# Altium schematic sheet Power Supply and Regulation.SchDoc: Power Supply and Regulation Section
size A4; DrawnBy: Avishka C. Herath; DocumentNumber: EN2160 #1; Revision: 1.12; SheetNumber: 1; SheetTotal: 3; Index Number: 200212F; Project: RFID Access Control System
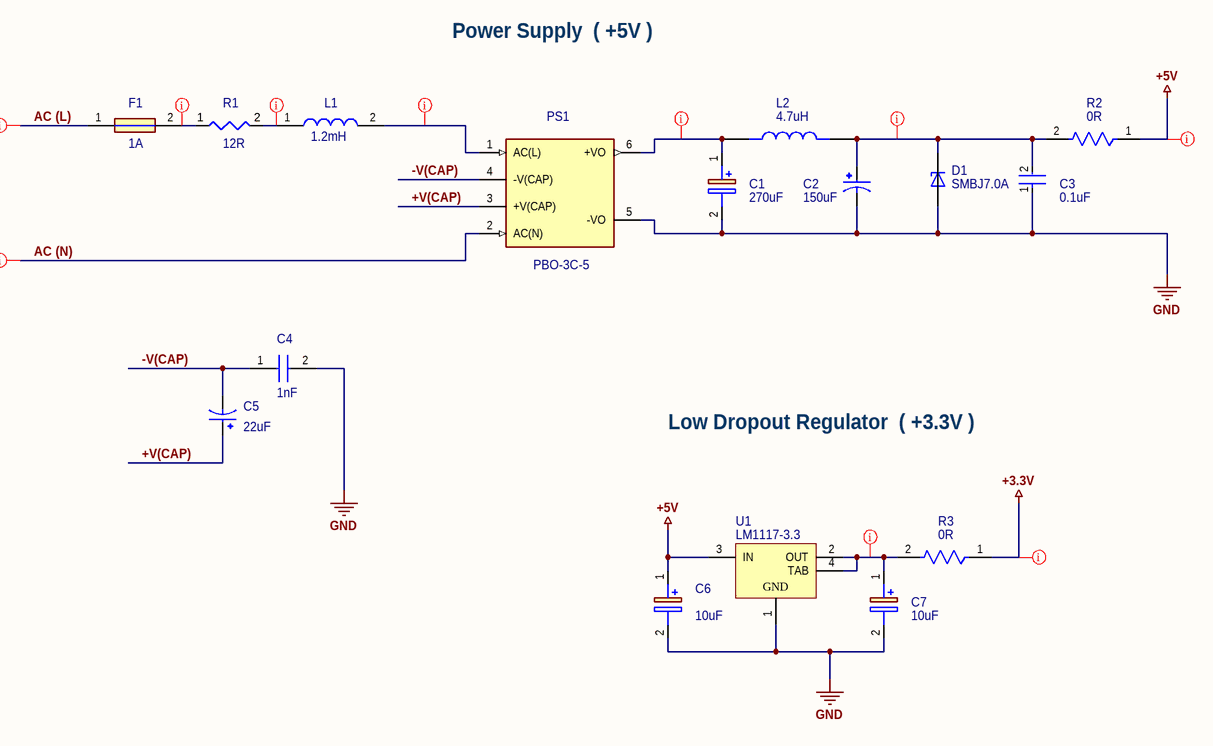
[diagram p0: Power Supply and Regulation.SchDoc]

## Parts
C1  270uF  [CAPPRD250W65D630H900]
C2  150uF  [CAPPRD500W60D800H1150]
C3  0.1uF  [FP-CL10-0_1-MFG]
C4  1nF  [B32529C8102J]
C5  22uF  [CAPPRD750W80D1600H2500]
C6  10uF  [T491B]
C7  10uF  [T491B]
D1  SMBJ7.0A  [DIOM4336X265N]
F1  1A  [SS5H1AAPH]
L1  1.2mH  [RLB9012122KL]
L2  4.7uH  [IND_ASPI-0615FS-4R7M-T2]
PS1  PBO-3C-5  [CONV_PBO-3C-5]
R1  12R  [WA84-12RJI-Footprint-1]
R2  0R  [FP-RC0805-MFG]
R3  0R  [FP-RC0805-MFG]
U1  LM1117-3.3  [DCY0004A_L]

## Nets
+3.3V: R3.1
+5V: C6.1(+) R2.1 U1.3(IN)
GND: C1.2(-) C2.N C3.1 C4.2 C6.2(-) C7.2(-) D1.A PS1.5(-VO) U1.1(GND)
+V(CAP): C5.P PS1.3(+V(CAP))
-V(CAP): C4.1 C5.N PS1.4(-V(CAP))
AC (L): F1.1
AC (N): PS1.2(AC(N))
NetC1_1: C1.1(+) L2.1 PS1.6(+VO)
NetC2_P: C2.P C3.2 D1.C L2.2 R2.2
NetC7_1: C7.1(+) R3.2 U1.2(OUT) U1.4(TAB)
NetF1_2: F1.2 R1.1
NetL1_1: L1.1 R1.2
NetL1_2: L1.2 PS1.1(AC(L))

Not connected (* = marked no-connect by the designer): PS1 4_2(-V(CAP)) 5_2(-VO)

## Layout directives
net class V_out: +3.3V, +5V, NetC1_1, NetC2_P, NetC7_1
net class AC: AC (L), AC (N), NetF1_2, NetL1_1, NetL1_2

## Notes on the sheet
- Power Supply  ( +5V )
- Low Dropout Regulator  ( +3.3V )
- Title:
- Size:
- Date:
- A4
- Document Number:
- Sheet
- Revision:
- of
- Project:
- Drawn By:

## Library data of the parts
C1 = 6SEPC560MW+TSS: Aluminum Organic Polymer Capacitors; Manufacturer_Name: KEMET; Manufacturer_Part_Number: A750EM277M1CAAE015; Datasheet Link: http://industrial.panasonic.com/cdbs/www-data/pdf/AAB8000/AAB8000C247.pdf; Height: 9mm; Mouser Part Number: 667-6SEPC560MW+TSS; Mouser Price/Stock: https://www.mouser.co.uk/ProductDetail/Panasonic/6SEPC560MW%2bTSS?qs=OE1iw1LrrPGkg%2Fufb0Bk8Q%3D%3D; Arrow Part Number: 6SEPC560MW+TSS; Arrow Price/Stock: https://www.arrow.com/en/products/6sepc560mwtss/panasonic?region=nac
C2 = EEUFR1V221B: FR-A; MF: {'manufacturer': u'Panasonic'}; MP: UHE1V151MPD1TD; Value: *; Price: None; Availability: Unavailable; Package: None
C3 = CMP-13271-000011-1: CAP CER 0.1UF 50V X7R 0603; Manufacturer: Samsung Electro-Mechanics America, Inc; Manufacturer Part Number: CL10B104JB8NNNC; Value: 100nF; Material: Ceramic; Temperature Coefficient: 15%; Tolerance: 5%; Ipc Land Pattern Name: CAPC16080X80; Device Class L1: Passive Components; Digikey Description: CAP CER 0.1UF 50V X7R 0603; Voltage Rating: 50V; Height: 0.9mm; ComponentLink2Description: Datasheet; Device Class L2: Capacitors; ComponentLink2URL: http://www.samsungsem.com/kr/support/product-search/mlcc/__icsFiles/afieldfile/2019/06/18/CL10B104JB8NNNC-19.pdf; Temperature Characteristic: X7R; Temperature Range High: +125°C; Lead Free: Yes; Temperature Range Low: -55°C; Category: Cap; Package: CL10-0.1; Temperature: -55°C to +125°C; Octopart: https://octopart.com/cl10b104jb8nnnc-samsung-9302151; Device Class L3: Ceramic Capacitors; RoHS: TRUE; Automotive: No; Capacitance: 100nF
C4 = B32529C8102J: Capacitor; Manufacturer_Name: TDK; Datasheet Link: https://componentsearchengine.com/Datasheets/1/B32529C8102J.pdf; Height: 6.5mm; Manufacturer_Part_Number: B32529C8102J; Mouser Part Number: 871-B32529C8102J; Mouser Price/Stock: https://www.mouser.co.uk/ProductDetail/EPCOS-TDK/B32529C8102J?qs=CveI%2FUwZDBKgVtfngCVMDw%3D%3D
C5 = EEUTP1E272B: Aluminum Electrolytic Capacitors - Radial Leaded; MF: Nichicon; MP: UVR2W220MHD; Value: 22uF; Price: None; Availability: Unavailable; Package: Bulk; ComponentLink1Description: Mouser; ComponentLink1URL: https://www.mouser.com/ProductDetail/Nichicon/UVR2W220MHD?qs=%252BlpsHQzXjw%2F%252B5drQqN1W8w%3D%3D; Supplier 1: Rs; Supplier Part Number 1: 5201365
C6 C7 = T491B106M010AT: Capacitor Polarised; Manufacturer_Name: KEMET; Datasheet Link: https://content.kemet.com/datasheets/KEM_T2005_T491.pdf; Height: 2.1mm; Manufacturer_Part_Number: T491B106M010AT; Mouser Part Number: 80-T491B106M010; Arrow Part Number: T491B106M010AT; Arrow Price/Stock: https://www.arrow.com/en/products/t491b106m010at/kemet-corporation?region=nac
D1 = SMBJ7.0A: MF: {'manufacturer': u'Littelfuse'}; Value: *; Price: None; Availability: Unavailable; Package: None; MP: SMBJ7.0A
F1 = CMP-018-000000-1: Fuse; Manufacturer_Name: Eaton; Datasheet Link: https://www.eaton.com/content/dam/eaton/products/electronic-components/resources/data-sheet/eaton-ss-5h-subminiature-radial-leaded-time-delay-fuses-data-sheet.pdf; Height: 8.55mm; Arrow Price/Stock: https://www.arrow.com/en/products/ss-5h-1a-aph/eaton?region=nac; Pin Count: 2; Source: SamacSys.SchLib; Design Item ID: SS-5H-1A-APH; Mouser Part Number: 504-SS-5H-1A-APH; Manufacturer_Part_Number: SS-5H-1A-APH; Arrow Part Number: SS-5H-1A-APH; Component Type: Standard; Mouser Price/Stock: https://www.mouser.co.uk/ProductDetail/Bussmann-Eaton/SS-5H-1A-APH?qs=uEhifBLpbD3ldHjMqFUUYA%3D%3D
L1 = RLB9012-122KL: Inductor; Manufacturer_Name: Bourns; Datasheet Link: https://datasheet.datasheetarchive.com/originals/dk/DKDS-12/225018.pdf; Height: 12.2mm; Manufacturer_Part_Number: RLB9012-122KL; Mouser Part Number: 652-RLB9012-122KL; Mouser Price/Stock: https://www.mouser.co.uk/ProductDetail/Bourns/RLB9012-122KL?qs=dB0LedT%252BmmC%2Fvhpfl8NA4g%3D%3D; Arrow Part Number: RLB9012-122KL; Arrow Price/Stock: https://www.arrow.com/en/products/rlb9012-122kl/bourns?region=nac
L2 = ASPI-0615FS-4R7M-T2: MF: {'manufacturer': u'Abracon'}; Value: *; Price: None; Availability: Unavailable; Package: None; MP: ASPI-0615FS-4R7M-T2
PS1 = PBO-3C-5: MF: {'manufacturer': u'CUI'}; Value: *; Price: None; Availability: Unavailable; Package: None; MP: PBO-3C-5
R1 = CMP-009-00177-4: Through Hole Wirewound Resistor, Wa80 Series, 12 Ohm, 3 W, - 5%, 100 V, Axial Leaded Rohs Compliant: Yes; Body Length: 14.5mm; Lead Length: 24.55mm; Lead Diameter: 0.8mm; Body Diameter: 5.2mm; Case/Package: Axial
R2 R3 = CMP-2001-04570-2: RES SMD 0 OHM JUMPER 1/8W 0805; Manufacturer: Yageo; Manufacturer Part Number: RC0805FR-070RL; Resistance: 0Ω; Value: 0Ω; Power Rating: 0.125W; Tolerance: 1%; Voltage Rating: 150V; RoHS: TRUE; Device Class L2: Resistors; Composition: Thick Film; Device Class L1: Passive Components; Height: 0.6mm; Category: Res; Automotive: No; Device Class L3: Chip SMD Resistors; ComponentLink2URL: http://www.yageo.com/documents/recent/PYu-RC_Group_51_RoHS_L_10.pdf; Octopart: https://octopart.com/rc0805fr-070rl-yageo-9293404; Temperature Range High: +155°C; Ipc Land Pattern Name: RESC200125X50; Footprint Url: http://www.yageo.com/exep/pages/download/literatures/PYu-R_Mount_10.pdf; Series: RC_L; Digikey Description: RES SMD 0 OHM JUMPER 1/8W 0805; Temperature Range Low: -55°C; Temperature: -55°C to +155°C; Package: RC0805; ComponentLink2Description: Datasheet; Lead Free: Yes
U1 = CMP-0062-01639-4: 800mA Low-Dropout Linear Regulator, 4-pin SOT-223, Pb-Free; PartNumber: LM1117MPX-3.3/NOPB; Manufacturer: Texas Instruments; High-Reliability: Y; PowerWise: N; PackageTopMarking: XYTT*N05A; CompType: LDO IC; ComponentLink1URL: http://www.ti.com/general/docs/lit/getliterature.tsp?genericPartNumber=LM1117-N&fileType=pdf; ComponentLink1Description: Datasheet URL; PinCount: 4; Code_JEDEC: TO-261-AA; PackageDescription: Molded SOT-223, 6.50 x 3.56 x 1.6mm Body, 4 Lead, 2.3mm Pitch; PackageReference: DCY0004A; RoHS: Y; Code_IPC: SOT223-4